# EasyEDA schematic Měnič1.json
TITLE: Sheet_1; REV: 1.0; Date: 2024-04-06; Sheet: 1/1; Drawn By: romansuk05; Company: Your Company
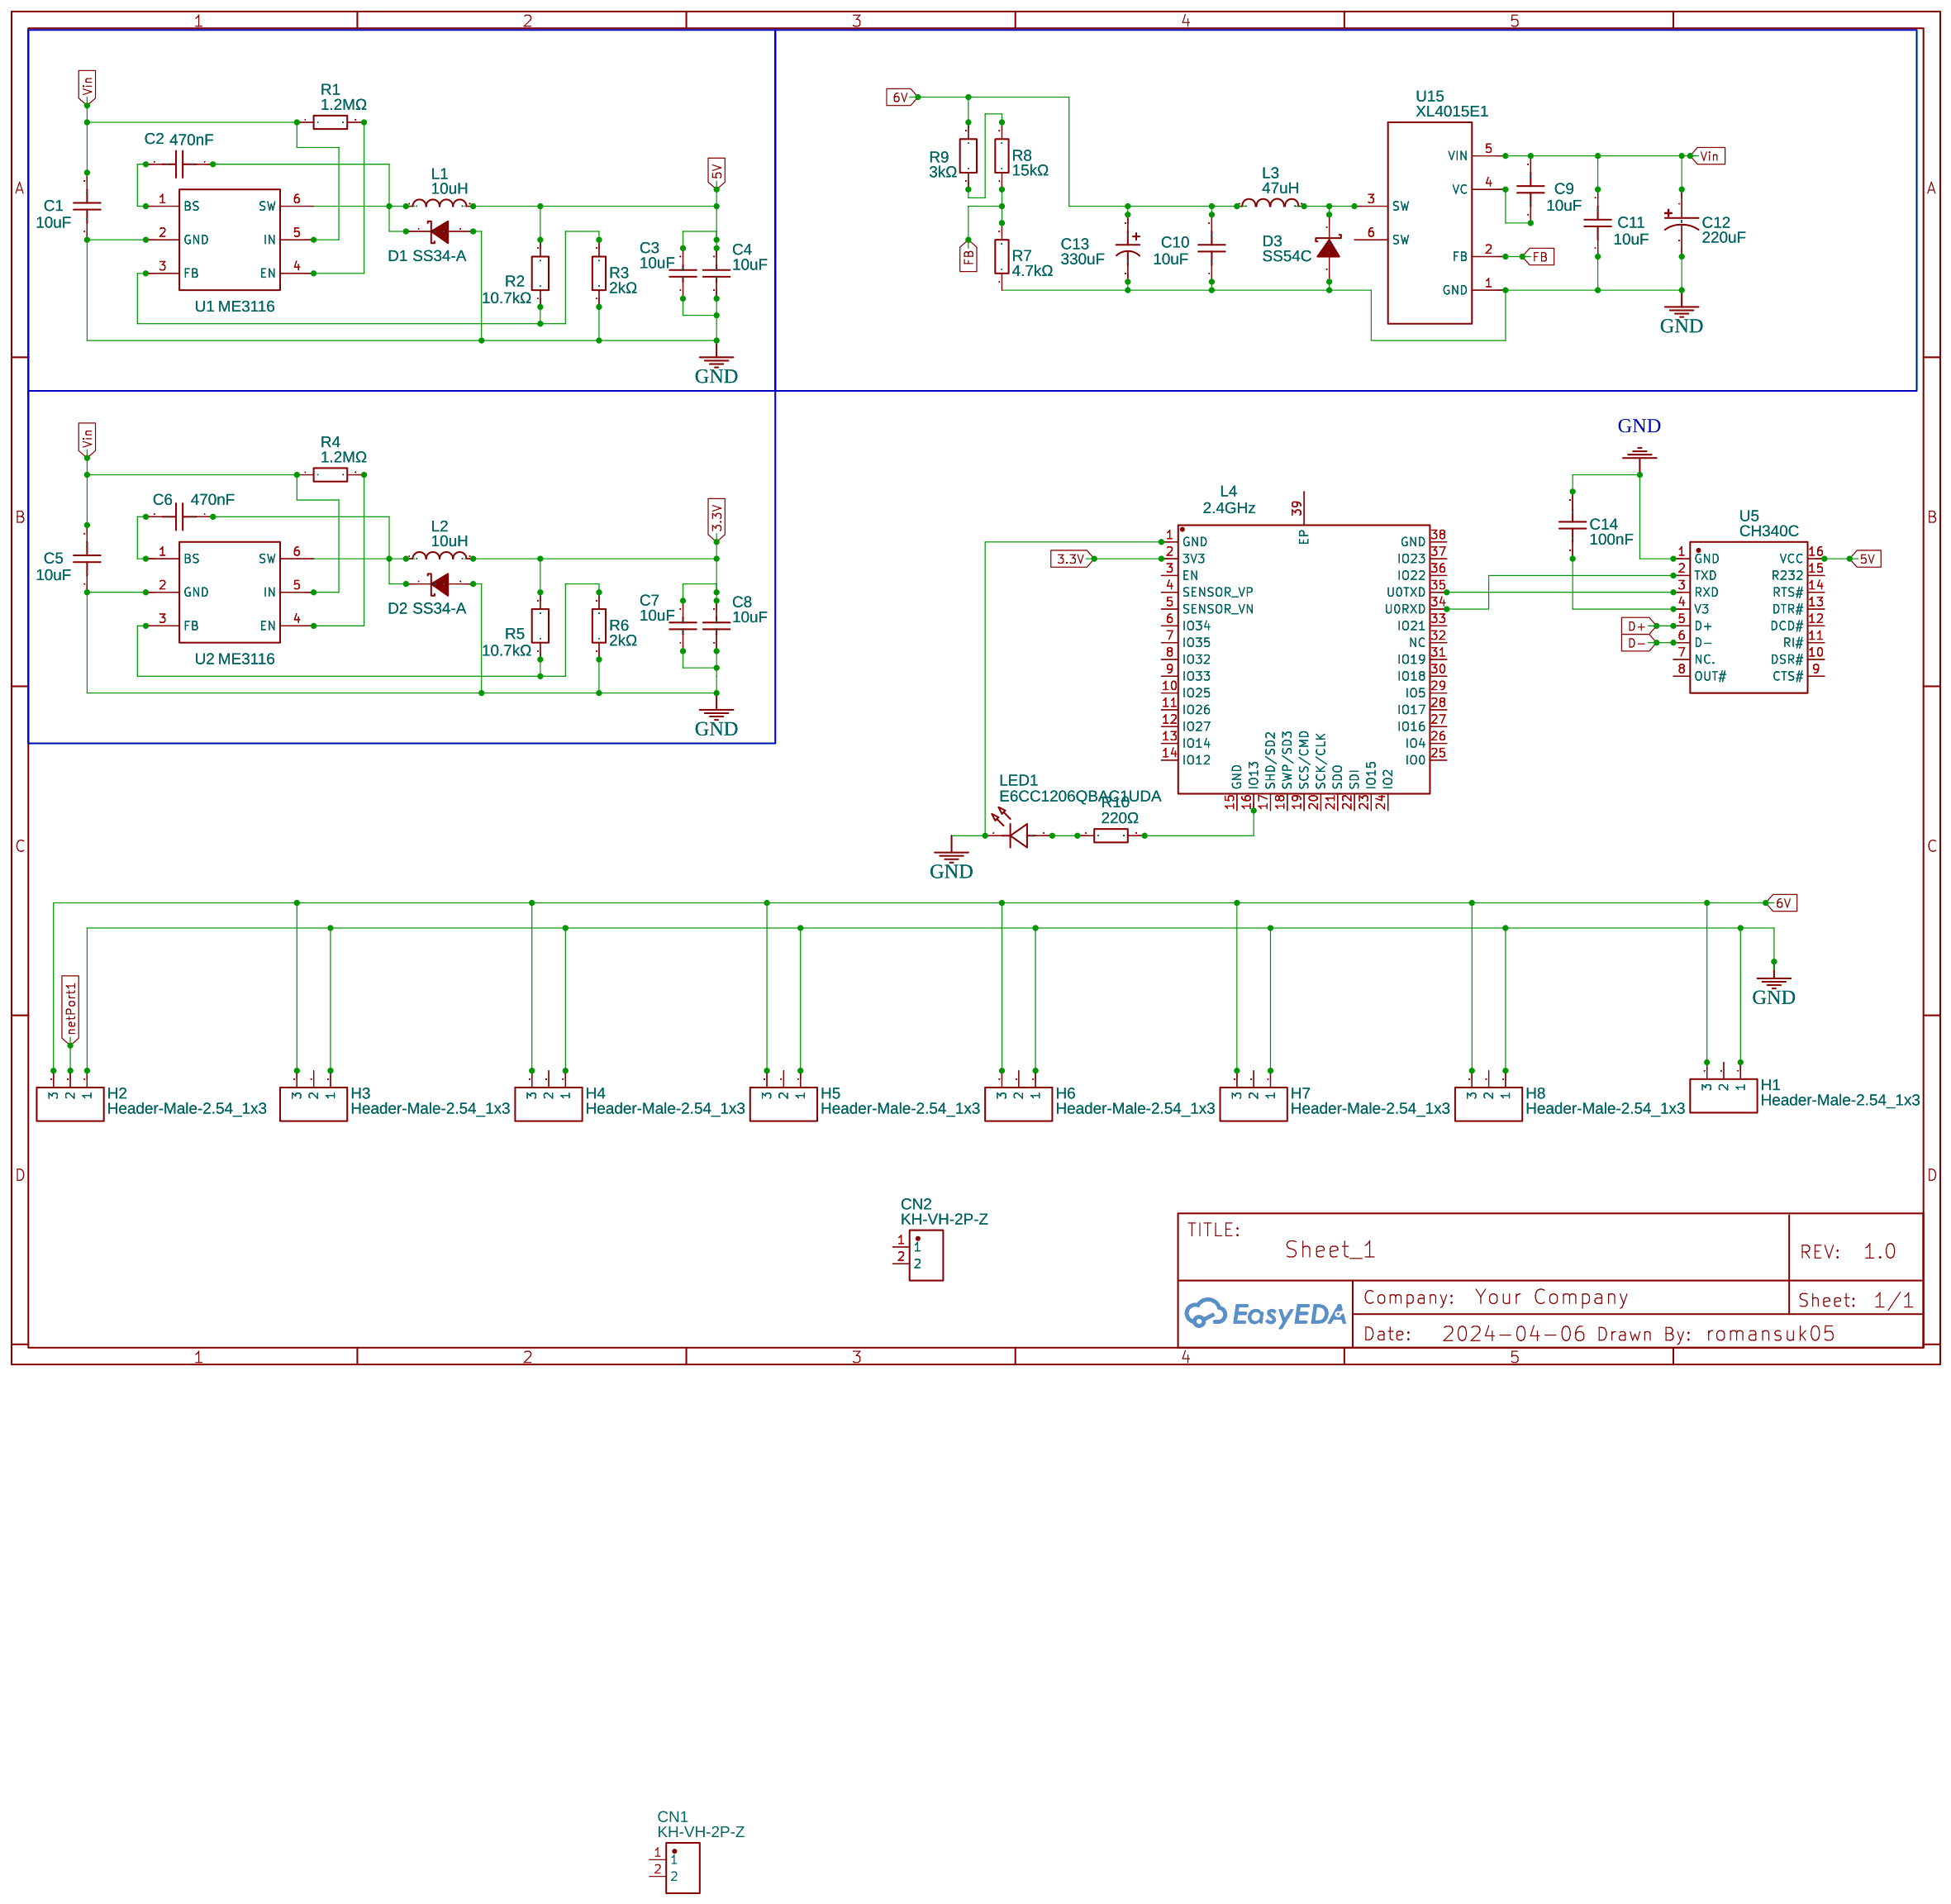
[diagram p0: schematic sheet]

## Parts
C1  10uF  [C1206]
C2  470nF  [C1206]
C3  10uF  [C1206]
C4  10uF  [C1206]
C5  10uF  [C1206]
C6  470nF  [C1206]
C7  10uF  [C1206]
C8  10uF  [C1206]
C9  10uF  [C1206]
C10  10uF  [C1206]
C11  10uF  [C1206]
C12  220uF  [CAP-SMD_BD10.0-L10.3-W10.3-FD-LS11.0]
C13  330uF  [CAP-SMD_BD6.3-L6.6-W6.6-LS7.6-RD]
C14  100nF  [C1206]
CN1  KH-VH-2P-Z  [CONN-TH_KH-VH-2P-Z]
CN2  KH-VH-2P-Z  [CONN-TH_KH-VH-2P-Z]
D1  SS34-A  [SMA_L4.3-W2.6-LS5.2-RD]
D2  SS34-A  [SMA_L4.3-W2.6-LS5.2-RD]
D3  SS54C  [SMC_L7.5-W5.8-LS8.3-RD]
H1  Header-Male-2.54_1x3  [HDR-TH_3P-P2.54-V-M-1]
H2  Header-Male-2.54_1x3  [HDR-TH_3P-P2.54-V-M-1]
H3  Header-Male-2.54_1x3  [HDR-TH_3P-P2.54-V-M-1]
H4  Header-Male-2.54_1x3  [HDR-TH_3P-P2.54-V-M-1]
H5  Header-Male-2.54_1x3  [HDR-TH_3P-P2.54-V-M-1]
H6  Header-Male-2.54_1x3  [HDR-TH_3P-P2.54-V-M-1]
H7  Header-Male-2.54_1x3  [HDR-TH_3P-P2.54-V-M-1]
H8  Header-Male-2.54_1x3  [HDR-TH_3P-P2.54-V-M-1]
L1  10uH  [IND-SMD_L7.8-W7.0_APC07A50]
L2  10uH  [IND-SMD_L7.8-W7.0_APC07A50]
L3  47uH  [IND-SMD_L4.5-W4.0_GCD43-XX]
L4  2.4GHz  [WIRELM-SMD_ESP32-S]
LED1  E6CC1206QBAC1UDA  [LED1206-RD_BLUE-GH_E6CC1206QBAC1UDA]
R1  1.2MΩ  [R1206]
R2  10.7kΩ  [R1206]
R3  2kΩ  [R1206]
R4  1.2MΩ  [R1206]
R5  10.7kΩ  [R1206]
R6  2kΩ  [R1206]
R7  4.7kΩ  [R1206]
R8  15kΩ  [R1206]
R9  3kΩ  [R1206]
R10  220Ω  [R1206]
U1  ME3116  [SOT-23-6_L2.9-W1.6-P0.95-LS2.8-BL]
U2  ME3116  [SOT-23-6_L2.9-W1.6-P0.95-LS2.8-BL]
U5  CH340C  [SOP-16_L10.0-W3.9-P1.27-LS6.0-BL]
U15  XL4015E1  [TO-263-5_L10.2-W8.9-P1.70-TL]

## Library data of the parts
C1 C5 C9-C11 = TCC1206X7R106K250HT: Contributor: LCSC; Supplier: LCSC; Supplier Part: C380364; Manufacturer: CCTC(三环); JLCPCB Part Class: Extended Part
C2 C6 = TCC1206X7R474K500FT: Contributor: LCSC; Supplier: LCSC; Supplier Part: C282872; Manufacturer: CCTC(三环); JLCPCB Part Class: Extended Part
C3 C4 C7 C8 = TMK316B7106KL-TD: Supplier: LCSC; Manufacturer: TAIYO YUDEN(太诱); Supplier Part: C92831; JLCPCB Part Class: Extended Part
C12 = BXJ-50V220-10*10: Contributor: LCSC; Supplier: LCSC; Supplier Part: C165634; Manufacturer: SAMYOUNG(韩国三莹); Manufacturer Part: BXJ50V220M10*10 10TP; JLCPCB Part Class: Extended Part
C13 = 189RV0016: Supplier: LCSC; Supplier Part: C7471878; Manufacturer: KNSCHA(科尼盛); Contributor: lcsc; JLCPCB Part Class: Extended Part
C14 = 1206Y1000104KXR: Contributor: LCSC; Supplier: LCSC; Supplier Part: C2319128; Manufacturer: Knowles(楼氏); JLCPCB Part Class: Extended Part
CN1 CN2 = KH-VH-2P-Z: JLCPCB Part Class: Extended Part; Contributor: LCSC; Supplier: LCSC; Supplier Part: C2761176; Manufacturer: kinghelm(金航标)
D1 D2 = SS34-A: Contributor: LCSC; Supplier: LCSC; Supplier Part: C143201; Manufacturer: FMS(美丽微); JLCPCB Part Class: Extended Part
D3 = SS54C: Contributor: LCSC; Supplier: LCSC; Supplier Part: C330398; Manufacturer: LGE(鲁光); Manufacturer Part: SS54; JLCPCB Part Class: Extended Part
H1-H8 = Header-Male-2.54_1x3: Supplier: LCSC; Manufacturer: BOOMELE(博穆精密); Manufacturer Part: 2.54-1*3P针; Supplier Part: C49257; JLCPCB Part Class: Extended Part
L1 L2 = CY75SX-10UH: Contributor: LCSC; Supplier: LCSC; Supplier Part: C2879701; Manufacturer: SHOU HAN(首韩); JLCPCB Part Class: Extended Part
L3 = GCD43-470MC: Contributor: LCSC; Supplier: LCSC; Supplier Part: C439248; Manufacturer: GLE(格莱尔); Manufacturer Part: GCCD4532N-470M01; JLCPCB Part Class: Extended Part
L4 = ESP32-S(16MB): Contributor: lcsc; Supplier: LCSC; Supplier Part: C2991923; Manufacturer: Ai-Thinker(安信可); JLCPCB Part Class: Extended Part
LED1 = E6CC1206QBAC1UDA: Contributor: LCSC; Supplier: LCSC; Supplier Part: C375563; Manufacturer: ekinglux(亿晶源); JLCPCB Part Class: Extended Part
R1 R4 = WR12W1204FTL: Contributor: LCSC; Supplier: LCSC; Manufacturer: Walsin(华新科); Supplier Part: C171052; JLCPCB Part Class: Extended Part
R2 R5 = RC1206FR-0710K7L: Contributor: LCSC; Supplier: LCSC; Supplier Part: C488612; Manufacturer: YAGEO(国巨); JLCPCB Part Class: Extended Part
R3 R6 = RTT06202JTP: Supplier: LCSC; Manufacturer: RALEC(旺诠); Supplier Part: C104689; JLCPCB Part Class: Extended Part
R7 = CRCW12064K70FKEA: Contributor: LCSC; Supplier: LCSC; Supplier Part: C242482; Manufacturer: VISHAY(威世); JLCPCB Part Class: Extended Part
R8 = RT1206FRD0715KL: Contributor: LCSC; Supplier: LCSC; Manufacturer: YAGEO(国巨); Supplier Part: C136874; JLCPCB Part Class: Extended Part
R9 = CR1206J3K00P05Z: Contributor: LCSC; Supplier: LCSC; Supplier Part: C881253; Manufacturer: EVER OHMS(天二科技); JLCPCB Part Class: Extended Part
R10 = CR1206F42200G: Supplier: LCSC; Manufacturer: LIZ(丽智电子); Supplier Part: C102128; JLCPCB Part Class: Extended Part
U1 U2 = ME3116: Supplier: LCSC; Manufacturer: MICRONE(南京微盟); Manufacturer Part: ME3116AM6G; Supplier Part: C97643; JLCPCB Part Class: Extended Part
U5 = CH340C: Supplier: LCSC; Manufacturer: WCH(南京沁恒); Supplier Part: C84681; JLCPCB Part Class: Extended Part
U15 = XL4015E1: Supplier: LCSC; Manufacturer: XLSEMI(芯龙); Supplier Part: C51661; JLCPCB Part Class: Extended Part

## Nets
3.3V: C7.2 C8.2 L2.2 L4.2(3V3) R5.2
5V: C3.2 C4.2 L1.2 R2.2 U5.16(VCC)
6V: C10.2 C13.1 H1.3 H2.3 H3.3 H4.3 H5.3 H6.3 H7.3 H8.3 L3.1 R9.2
GND: C1.1 C3.1 C4.1 C5.1 C7.1 C8.1 C10.1 C11.1 C12.2 C13.2 C14.2 D1.2(A) D2.2(A) D3.2(A) H1.1 H2.1 H3.1 H4.1 H5.1 H6.1 H7.1 H8.1 L4.1(GND) LED1.1(K) R3.1 R6.1 R7.1 U1.2(GND) U2.2(GND) U5.1(GND) U15.1(GND)
Vin: C1.2 C5.2 C9.2 C11.2 C12.1 R1.1 R4.1 U1.5(IN) U2.5(IN) U15.5(VIN)
D+: U5.5(D+)
D-: U5.6(D-)
FB: R7.2 R8.1 U15.2(FB)
netPort1: H2.2
Net-(C2-1): C2.1 D1.1(C) L1.1 U1.6(SW)
Net-(C2-2): C2.2 U1.1(BS)
Net-(C6-1): C6.1 D2.1(C) L2.1 U2.6(SW)
Net-(C6-2): C6.2 U2.1(BS)
Net-(C9-1): C9.1 U15.4(VC)
Net-(C14-1): C14.1 U5.4(V3)
Net-(D3-1): D3.1(K) L3.2 U15.3(SW)
Net-(L4-16): L4.16(IO13) R10.2
Net-(L4-34): L4.34(U0RXD) U5.2(TXD)
Net-(L4-35): L4.35(U0TXD) U5.3(RXD)
Net-(LED1-2): LED1.2(A) R10.1
Net-(R1-2): R1.2 U1.4(EN)
Net-(R2-1): R2.1 R3.2 U1.3(FB)
Net-(R4-2): R4.2 U2.4(EN)
Net-(R5-1): R5.1 R6.2 U2.3(FB)
Net-(R8-2): R8.2 R9.1

Not connected (* = marked no-connect by the designer): CN1 1 2; CN2 1 2; H1 2; H3 2; H4 2; H5 2; H6 2; H7 2; H8 2; L4 3(EN) 4(SENSOR_VP) 5(SENSOR_VN) 6(IO34) 7(IO35) 8(IO32) 9(IO33) 10(IO25) 11(IO26) 12(IO27) 13(IO14) 14(IO12) 15(GND) 17(SHD/SD2) 18(SWP/SD3) 19(SCS/CMD) 20(SCK/CLK) 21(SDO) 22(SDI) 23(IO15) 24(IO2) 25(IO0) 26(IO4) 27(IO16) 28(IO17) 29(IO5) 30(IO18) 31(IO19) 32(NC) 33(IO21) 36(IO22) 37(IO23) 38(GND) 39(EP); U5 7(NC.) 8(OUT#) 9(CTS#) 10(DSR#) 11(RI#) 12(DCD#) 13(DTR#) 14(RTS#) 15(R232); U15 6(SW)
